# EasyEDA Pro project ProPrj_OpenHaldexC6_2025-10-16.epro

# Schematic Schematic1
Board Name: Board1; Create Date: 2025-10-07; Page Name: P1; Project Name: OpenHaldexC6; Schematic Name: Schematic1; Update Date: 2025-10-15; Company: EasyEDA.com; Page Size: A4; Version: V1.0
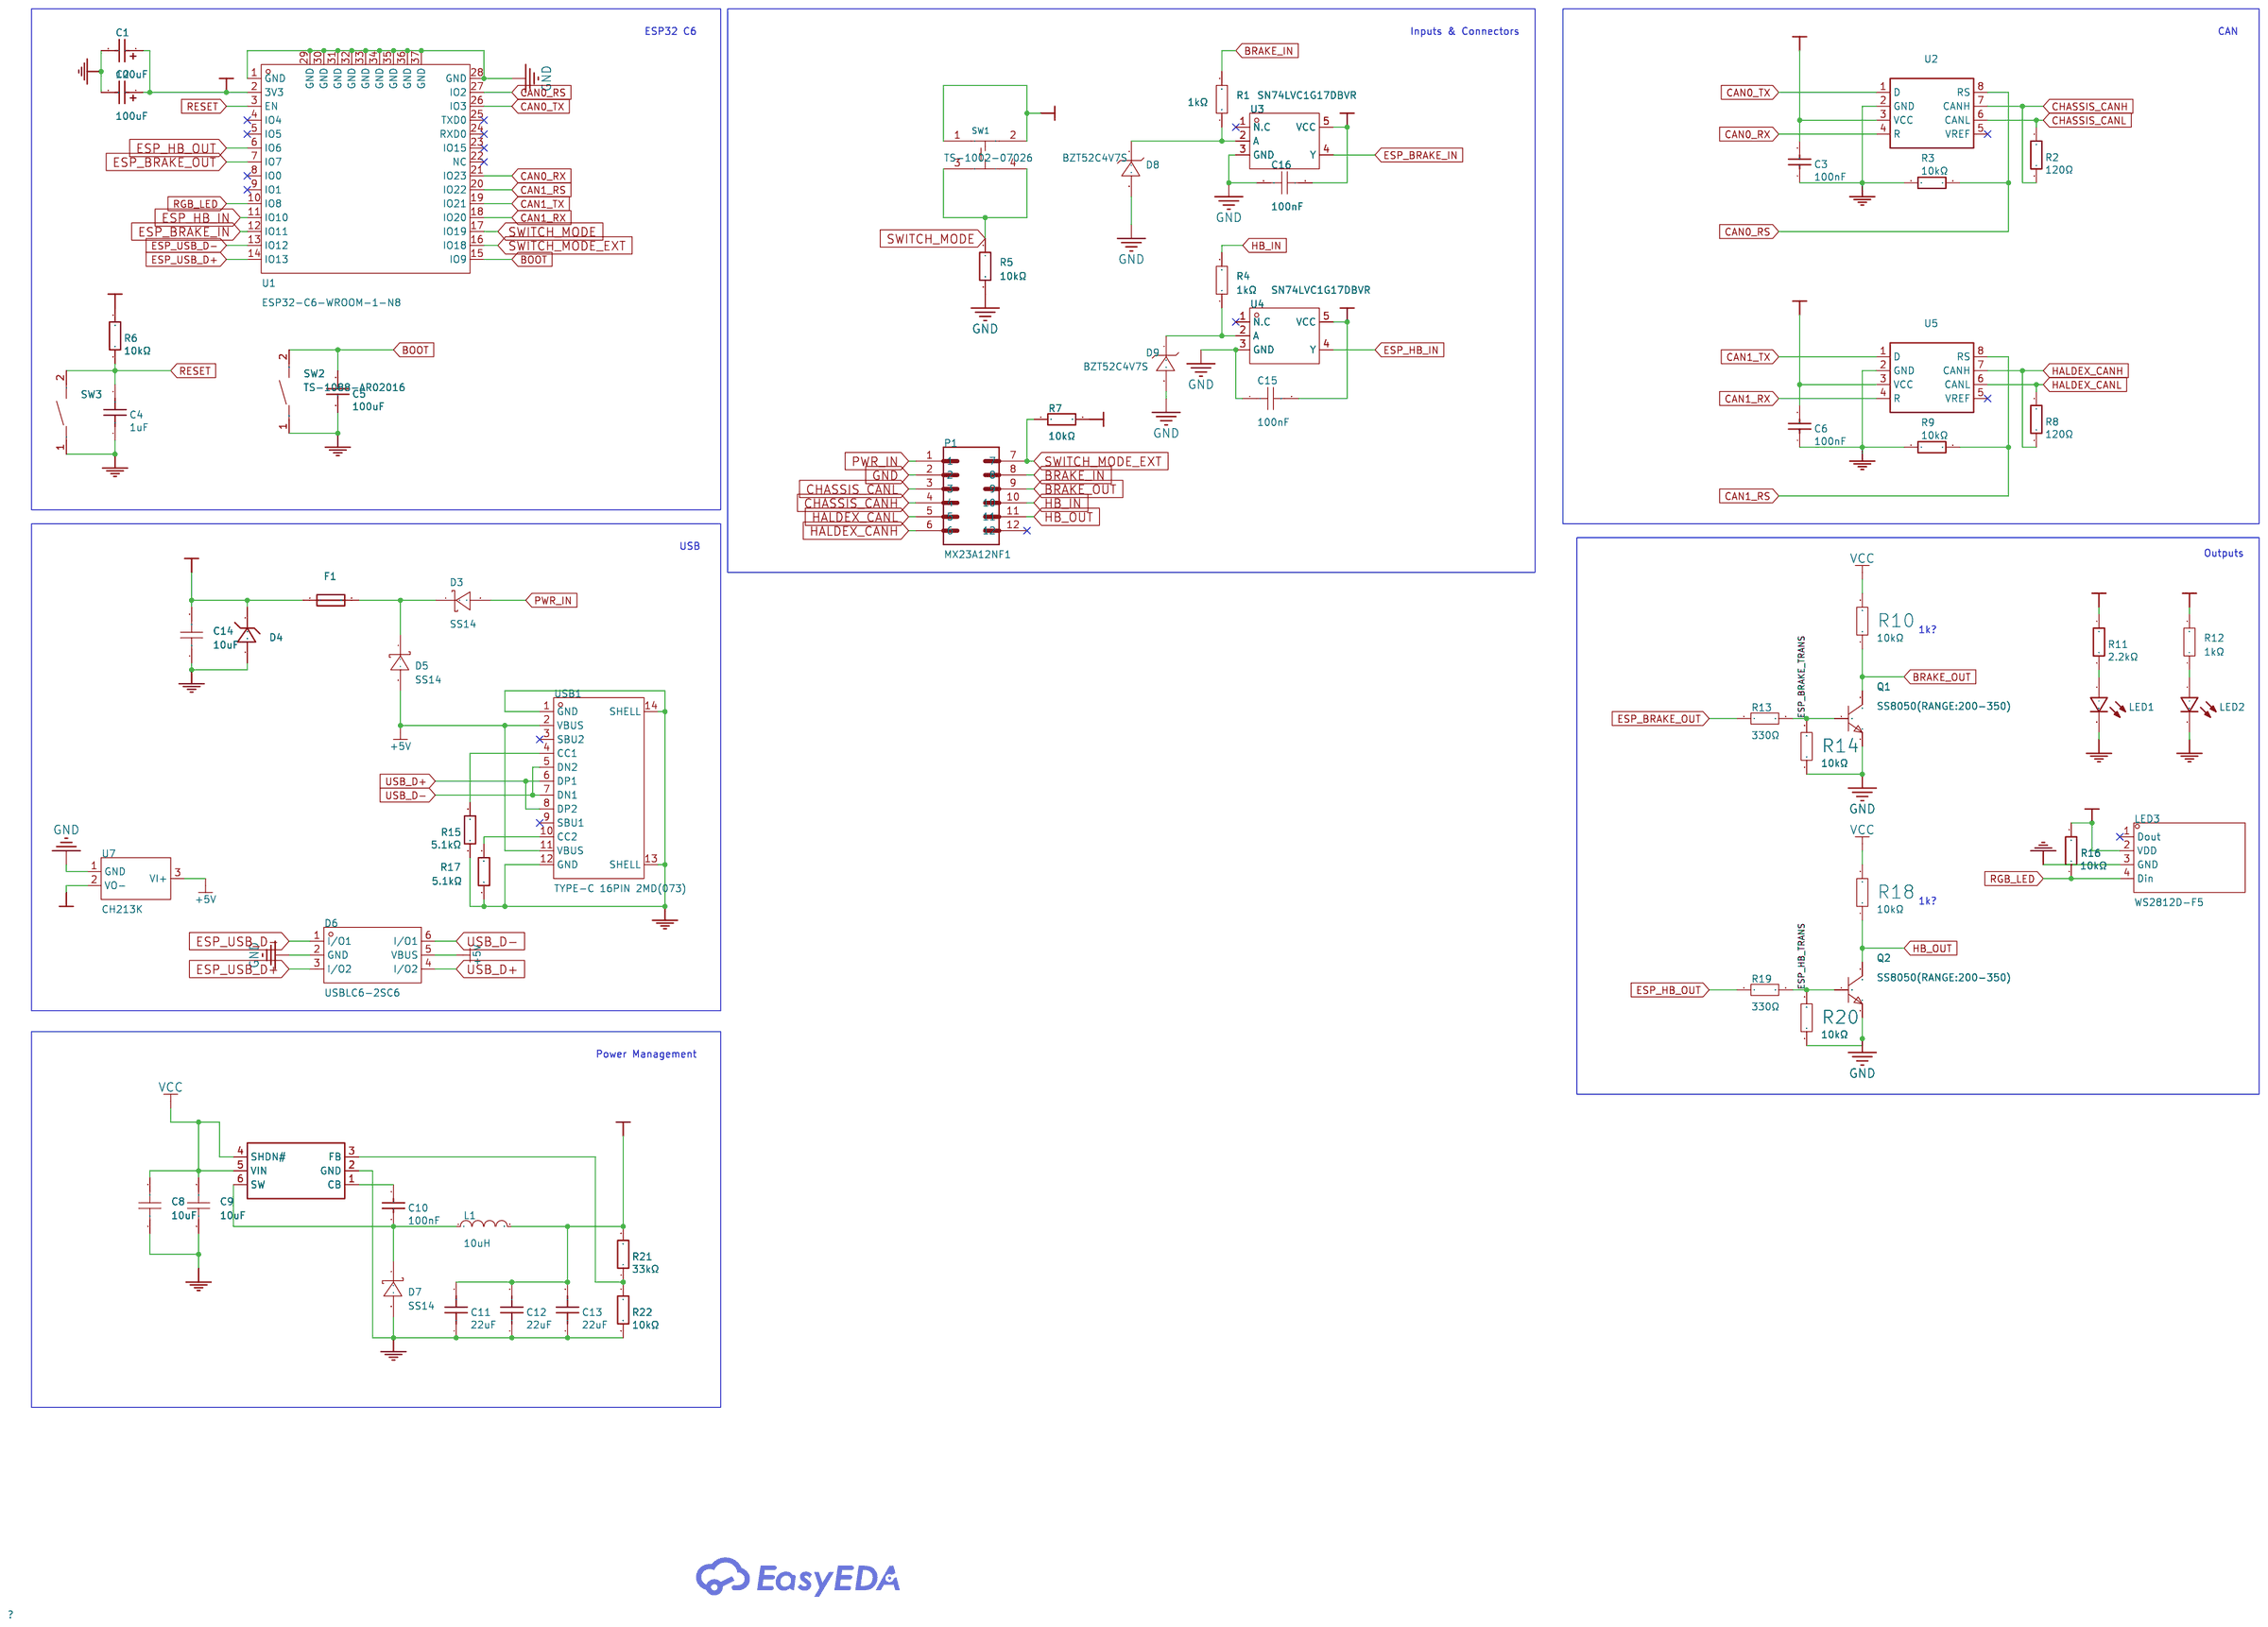
[diagram p0: schematic sheet]

## Parts
C1  100uF  [CASE-B_3528]
C2  100uF  [CASE-B_3528]
C3  100nF  [C0402]
C4  1uF  [C0402]
C5  100uF  [CASE-B_3528]
C6  100nF  [C0402]
C8  10uF  [C1206]
C9  10uF  [C1206]
C10  100nF  [C0402]
C11  22uF  [C0603]
C12  22uF  [C0603]
C13  22uF  [C0603]
C14  10uF  [C1206]
C15  100nF  [C0603]
C16  100nF  [C0603]
D3  SS14  [SMA_L4.2-W2.6-LS5.0-RD_1]
D4  SMF30A  [SOD-123_L2.8-W1.8-LS3.7-RD]
D5  SS14  [SMA_L4.2-W2.6-LS5.0-RD_1]
D6  USBLC6-2SC6  [SOT-23-6_L2.9-W1.6-P0.95-LS2.8-BL]
D7  SS14  [SMA_L4.2-W2.6-LS5.0-RD_1]
D8  BZT52C4V7S  [SOD-323_L1.8-W1.3-LS2.5-RD]
D9  BZT52C4V7S  [SOD-323_L1.8-W1.3-LS2.5-RD]
F1  MF-MSMF110/16-2  [F1812]
L1  10uH  [IND-SMD_L6.0-W6.0_FNR60XXS]
LED1  19-217/GHC-YR1S2/3T  [LED0603-RD]
LED2  19-217/GHC-YR1S2/3T  [LED0603-RD]
LED3  WS2812D-F5  [LED-TH_4P-BD5.8-P1.30]
P1  MX23A12NF1  [COON-TH_MX23A12NF1]
Q1  SS8050(RANGE:200-350)  [SOT-23-3_L2.9-W1.3-P1.90-LS2.4-BR]
Q2  SS8050(RANGE:200-350)  [SOT-23-3_L2.9-W1.3-P1.90-LS2.4-BR]
R1  1kΩ  [R0603]
R2  120Ω  [R1206]
R3  10kΩ  [R0402]
R4  1kΩ  [R0603]
R5  10kΩ  [R0402]
R6  10kΩ  [R0402]
R7  10kΩ  [R0402]
R8  120Ω  [R1206]
R9  10kΩ  [R0402]
R10  10kΩ  [R0603]
R11  2.2kΩ  [R0402]
R12  1kΩ  [R0402]
R13  330Ω  [R0603]
R14  10kΩ  [R0603]
R15  5.1kΩ  [R0402]
R16  10kΩ  [R0402]
R17  5.1kΩ  [R0402]
R18  10kΩ  [R0603]
R19  330Ω  [R0603]
R20  10kΩ  [R0603]
R21  33kΩ  [R0402]
R22  10kΩ  [R0402]
SW1  TS-1002-07026  [SW-TH_4P-L6.0-W6.0-P4.50-LS6.5]
SW2  TS-1088-AR02016  [SW-SMD_L3.9-W3.0-P4.45]
SW3  TS-1088-AR02016  [SW-SMD_L3.9-W3.0-P4.45]
U1  ESP32-C6-WROOM-1-N8  [WIRELM-SMD_ESP32-C6-WROOM-1]
U2  SN65HVD230DR  [SOIC-8_L4.9-W3.9-P1.27-LS6.0-BL]
U3  SN74LVC1G17DBVR  [SOT-23-5_L3.0-W1.5-P0.95-LS2.8-BL]
U4  SN74LVC1G17DBVR  [SOT-23-5_L3.0-W1.5-P0.95-LS2.8-BL]
U5  SN65HVD230DR  [SOIC-8_L4.9-W3.9-P1.27-LS6.0-BL]
U6  LMR14006XDDCR  [SOT-23-6_L2.9-W1.6-P0.95-LS2.8-BL]
U7  CH213K  [SOT-23-3_L2.9-W1.6-P1.90-LS2.8-BR]
USB1  TYPE-C 16PIN 2MD(073)  [USB-C-SMD_TYPE-C-6PIN-2MD-073]

## Library data of the parts
C1 C2 C5 = TAJB107K006RNJ: Capacitance:100uF Tolerance:±10% Tolerance:±10% Voltage Rating:6.3V Equivalent Series Resistance(ESR):1.7Ω@100kHz Operating Temperature:-55℃~+125℃ Operating Temperature:-55℃~+125℃; LCSC Part Name: 100uF ±10% 6.3V; Supplier Part: C16133; Manufacturer: Kyocera AVX; Supplier Footprint: CASE-B-3528-21(mm); JLCPCB Part Class: Basic Part; Supplier: LCSC; Tolerance: ±10%; Voltage Rating: 6.3V; Equivalent Series Resistance(ESR): 1.7Ω@100kHz; Operating Temperature: -55℃~+125℃
C3 C6 C10 = CL05B104KO5NNNC: Capacitance:100nF Tolerance:±10% Tolerance:±10% Voltage Rating:16V Temperature Coefficient:X7R; LCSC Part Name: 100nF ±10% 16V; Supplier Part: C1525; Manufacturer: SAMSUNG(三星); Supplier Footprint: 0402; JLCPCB Part Class: Basic Part; Datasheet: https://item.szlcsc.com/datasheet/CL05B104KO5NNNC/1877.html; Supplier: LCSC; Tolerance: ±10%; Voltage Rating: 16V; Temperature Coefficient: X7R
C4 = CL05A105KA5NQNC: Capacitance:1uF Tolerance:±10% Tolerance:±10% Voltage Rating:25V Temperature Coefficient:X5R; LCSC Part Name: 1uF ±10% 25V; Supplier Part: C52923; Manufacturer: SAMSUNG(三星); Supplier Footprint: 0402; JLCPCB Part Class: Basic Part; Datasheet: https://item.szlcsc.com/datasheet/CL05A105KA5NQNC/53938.html; Supplier: LCSC; Tolerance: ±10%; Voltage Rating: 25V; Temperature Coefficient: X5R
C8 C9 C14 = CS3216X7R106K350NRI: Capacitance:10uF Tolerance:±10% Tolerance:±10% Voltage Rating:35V Temperature Coefficient:-; LCSC Part Name: 10uF ±10% 35V; Supplier Part: C920965; Manufacturer: SAMWHA(三和); Supplier Footprint: 1206; JLCPCB Part Class: Extended Part; Supplier: LCSC; Tolerance: ±10%; Voltage Rating: 35V
C11-C13 = CL10A226MQ8NRNC: Capacitance:22uF Tolerance:±20% Tolerance:±20% Voltage Rating:6.3V Temperature Coefficient:X5R; LCSC Part Name: 22uF ±20% 6.3V; Supplier Part: C59461; Manufacturer: SAMSUNG(三星); Supplier Footprint: 0603; JLCPCB Part Class: Basic Part; Datasheet: https://item.szlcsc.com/datasheet/CL10A226MQ8NRNC/60514.html; Supplier: LCSC; Tolerance: ±20%; Voltage Rating: 6.3V; Temperature Coefficient: X5R
C15 C16 = CC0603KRX7R9BB104: Capacitance:100nF Tolerance:±10% Tolerance:±10% Voltage Rating:50V Temperature Coefficient:X7R; LCSC Part Name: 100nF ±10% 50V; Supplier Part: C14663; Manufacturer: YAGEO(国巨); Supplier Footprint: 0603; JLCPCB Part Class: Basic Part; Datasheet: https://item.szlcsc.com/datasheet/CC0603KRX7R9BB104/15331.html; Supplier: LCSC; Tolerance: ±10%; Voltage Rating: 50V; Temperature Coefficient: X7R
D3 D5 D7 = SS14_C2480: Diode Configuration:Independent Voltage - Forward(Vf@If):550mV@1A Voltage - DC Reverse(Vr):40V Current - Rectified:1A Reverse Leakage Current (Ir):300uA@40V Operating Junction Temperature Range:-55℃~+150℃ Operating Junction Temperature Range:-55℃~+150℃ No; LCSC Part Name: 电压:40V 电流:1A; Supplier Part: C2480; Manufacturer: MDD(辰达半导体); Supplier Footprint: SMA(DO-214AC); JLCPCB Part Class: Basic Part; Datasheet: https://item.szlcsc.com/datasheet/SS14/2857.html; Supplier: LCSC; Diode Configuration: Independent; Voltage - Forward(Vf@If): 550mV@1A; Voltage - DC Reverse(Vr): 40V; Current - Rectified: 1A; Reverse Leakage Current (Ir): 300uA@40V; Operating Junction Temperature Range: -55℃~+150℃; Non-Repetitive Peak Forward Surge Current: 25A
D4 = SMF30A_C366558: Reverse Stand-Off Voltage (Vrwm):30V Maximum Clamping Voltage:48.4V Peak Pulse Current (Ipp)@10/1000us:4.13A Breakdown Voltage:33.3V Type:TVS; Supplier Part: C366558; Manufacturer: DOWO(东沃); Supplier Footprint: SOD-123; JLCPCB Part Class: Extended Part; Datasheet: https://atta.szlcsc.com/upload/public/pdf/source/20190724/C406703_27801748953EFFDC130565EABDC01129.pdf; Supplier: LCSC; Reverse Stand-Off Voltage (Vrwm): 30V; Maximum Clamping Voltage: 48.4V; Peak Pulse Current (Ipp)@10/1000us: 4.13A; Breakdown Voltage: 33.3V; Type: TVS
D6 = USBLC6-2SC6_C2687116: Maximum Clamping Voltage:15V Breakdown Voltage:6V Number of Lines:双路 Type:ESD; Supplier Part: C2687116; Manufacturer: UMW(友台半导体); Supplier Footprint: SOT-23-6; JLCPCB Part Class: Extended Part; Datasheet: https://atta.szlcsc.com/upload/public/pdf/source/20231109/512642D850D9873E7C519F71E85B9A10.pdf; Supplier: LCSC; Maximum Clamping Voltage: 15V; Breakdown Voltage: 6V; Number of Lines: 双路; Type: ESD
D8 D9 = BZT52C4V7S_C353517: Diode Configuration:Independent Zener Voltage(Nom):4.7V Reverse Leakage Current (Ir):3uA@2V Zener Voltage(Range):4.4V~5V Zener Voltage(Range):4.4V~5V Pd - Power Dissipation:200mW Impedance(Zzt):80Ω Operating Junction Temperature Range:-55℃~+150℃ Operating; LCSC Part Name: 独立式 耐压:4.7V 电流:3uA@2V; Supplier Part: C353517; Manufacturer: 晶导微电子; Supplier Footprint: SOD-323; JLCPCB Part Class: Extended Part; Datasheet: https://item.szlcsc.com/datasheet/BZT52C4V7S/329266.html; Supplier: LCSC; Diode Configuration: Independent; Zener Voltage(Nom): 4.7V; Reverse Leakage Current (Ir): 3uA@2V; Zener Voltage(Range): 4.4V~5V; Pd - Power Dissipation: 200mW; Impedance(Zzt): 80Ω; Operating Junction Temperature Range: -55℃~+150℃
F1 = MF-MSMF110/16-2: Voltage - Max:- Current - Max:- Hold Current:- Trip Current:- Power Dissipation:800mW Resistance - Initial (Ri) (Min):40mΩ Resistance - Post Trip (R1) (Max):210mΩ Time to Trip(Max):- Operating Temperature:-40℃~+85℃ Operating Temperature:-40℃~+85℃ Length:-; LCSC Part Name: 16V 1.1A 1812自恢复; Supplier Part: C210834; Manufacturer: BOURNS; Supplier Footprint: 1812; JLCPCB Part Class: Extended Part; Datasheet: https://item.szlcsc.com/datasheet/MF-MSMF110%252F16-2/211712.html; Supplier: LCSC; Power Dissipation: 800mW; Resistance - Initial (Ri) (Min): 40mΩ; Resistance - Post Trip (R1) (Max): 210mΩ; Operating Temperature: -40℃~+85℃
L1 = FNR6045S100MT: Inductance:10uH Tolerance:±20% Tolerance:±20% Current Rating:2.7A Current - Saturation(Isat):3.5A DC Resistance(DCR):0.062Ω Type:Magnetic Core Shielded Winding Alloy Inductor; LCSC Part Name: 10uH ±20% 3.5A; Supplier Part: C168076; Manufacturer: cjiang(长江微电); Supplier Footprint: SMD,6x6mm; JLCPCB Part Class: Extended Part; Datasheet: https://atta.szlcsc.com/upload/public/pdf/source/20190327/C167925_9EFF0AABC4CA629C2CC95961DBF7D39D.pdf; Supplier: LCSC; Tolerance: ±20%; Current Rating: 2.7A; Current - Saturation(Isat): 3.5A; DC Resistance(DCR): 0.062Ω; Type: Magnetic Core Shielded Winding Alloy Inductor
LED1 LED2 = 19-217/GHC-YR1S2/3T: Illumination Color:Emerald Green Voltage - Forward(Vf):3.3V Voltage - Forward(Vf):3.3V Power(Watts):110mW Forward Current:20mA Wavelength - Dominant:520nm~535nm Wavelength - Dominant:520nm~535nm Peak Wavelength:518nm Diode Configuration:- Lens Color:Water; LCSC Part Name: 翠绿 停产; Supplier Part: C72043; Manufacturer: EVERLIGHT(亿光); Supplier Footprint: 0603; JLCPCB Part Class: Extended Part; Supplier: LCSC; Illumination Color: Emerald Green; Voltage - Forward(Vf): 3.3V; Power(Watts): 110mW; Forward Current: 20mA; Wavelength - Dominant: 520nm~535nm; Peak Wavelength: 518nm; Lens Color: Water Clear; Luminous Intensity: 199mcd; Viewing Angle: 120°; Operating Temperature: -40℃~+85℃
LED3 = WS2812D-F5: Wavelength:R:620nm~625nm；B:465nm~470nm；G:520nm~525nm Luminous Intensity:G:4000mcd；R:3000mcd；B:2500mcd Fixed-Frequency Pwm Mode:2kHz Data Transmission Rate:800Kbit/s Voltage - Supply:3.7V~5.3V Voltage - Supply:3.7V~5.3V Operating Temperature:-25℃~+85℃ Peak; LCSC Part Name: 智能控制通孔式LED集成光源; Supplier Part: C190565; Manufacturer: worldsemi; Supplier Footprint: 插件,D=5mm; JLCPCB Part Class: Extended Part; Datasheet: https://item.szlcsc.com/datasheet/WS2812D-F5/211094.html; Supplier: LCSC; Wavelength: R:620nm~625nm；B:465nm~470nm；G:520nm~525nm; Luminous Intensity: G:4000mcd；R:3000mcd；B:2500mcd; Fixed-Frequency Pwm Mode: 2kHz; Data Transmission Rate: 800Kbit/s; Voltage - Supply: 3.7V~5.3V; Operating Temperature: -25℃~+85℃; Peak Wavelength: G:522.5nm；R:622.5nm；B:467.5nm
P1 = MX23A12NF1: Supplier Part: C5359486; Manufacturer: JAE(日本航空电子); JLCPCB Part Class: Extended Part; Datasheet: https://atta.szlcsc.com/upload/public/pdf/source/20230330/B7F7CF0886F51BD2154D3E2774694052.pdf; Supplier: LCSC
Q1 Q2 = SS8050(RANGE:200-350)_C2150: type:NPN Current - Collector(Ic):1.5A Collector - Emitter Voltage VCEO:25V Pd - Power Dissipation:300mW DC Current Gain:200@800mA,1V DC Current Gain:200@800mA,1V Transition frequency(fT):100MHz Current - Collector Cutoff:100nA Vce Saturation(VCE(sat)):500; LCSC Part Name: hfe=200~350 NPN 电流:1.5A 电压:25V; Supplier Part: C2150; Manufacturer: CJ(江苏长电/长晶); Supplier Footprint: SOT-23; JLCPCB Part Class: Basic Part; Datasheet: https://item.szlcsc.com/datasheet/SS8050(RANGE%253A200-350)/2507.html; Supplier: LCSC; type: NPN; Current - Collector(Ic): 1.5A; Collector - Emitter Voltage VCEO: 25V; Pd - Power Dissipation: 300mW; DC Current Gain: 200@800mA,1V; Transition frequency(fT): 100MHz; Current - Collector Cutoff: 100nA; Vce Saturation(VCE(sat)): 500mV@800mA,80mA; Operating Temperature: -55℃~+150℃; Emitter-Base Voltage(Vebo): 5V; Number: 1 NPN
R1 R4 = 0603WAF1001T5E: Type:Thick Film Resistors Resistance:1kΩ Tolerance:±1% Tolerance:±1% Power(Watts): Overload Voltage (Max): Temperature Coefficient:±100ppm/℃ Temperature Coefficient:±100ppm/℃ Operating Temperature Range:-55℃~+155℃ Operating Temperature Range:-55℃~+155℃; LCSC Part Name: 1kΩ ±1% 100mW 厚膜电阻; Supplier Part: C21190; Manufacturer: UNI-ROYAL(厚声); Supplier Footprint: 0603; JLCPCB Part Class: Basic Part; Datasheet: https://atta.szlcsc.com/upload/public/pdf/source/20200306/C422600_1E6D84923E4A46A82E41ADD87F860B5C.pdf; Supplier: LCSC; Type: Thick Film Resistors; Tolerance: ±1%; Temperature Coefficient: ±100ppm/℃; Operating Temperature Range: -55℃~+155℃; Check: true
R2 R8 = RTT061200FTP: Type:Thick Film Resistor Resistance:120Ω Tolerance:±1% Tolerance:±1% Power(Watts):250mW Voltage-Supply(Max):150V Temperature Coefficient:±100ppm/℃ Temperature Coefficient:±100ppm/℃ Operating Temperature:-55℃~+155℃ Operating Temperature:-55℃~+155℃; LCSC Part Name: 厚膜电阻 120Ω ±1% 250mW; Supplier Part: C159715; Manufacturer: RALEC(旺诠); Supplier Footprint: 1206; JLCPCB Part Class: Extended Part; Datasheet: https://item.szlcsc.com/datasheet/RTT061200FTP/171094.html; Supplier: LCSC; Type: Thick Film Resistor; Tolerance: ±1%; Power(Watts): 250mW; Voltage-Supply(Max): 150V; Temperature Coefficient: ±100ppm/℃; Operating Temperature: -55℃~+155℃
R3 R5-R7 R9 R16 R22 = 0402WGF1002TCE: Type:Thick Film Resistor Resistance:10kΩ Tolerance:±1% Tolerance:±1% Power(Watts):62.5mW Voltage-Supply(Max):50V Temperature Coefficient:±100ppm/℃ Temperature Coefficient:±100ppm/℃ Operating Temperature:-55℃~+155℃ Operating Temperature:-55℃~+155℃; LCSC Part Name: 10kΩ ±1% 62.5mW 厚膜电阻; Supplier Part: C25744; Manufacturer: UNI-ROYAL(厚声); Supplier Footprint: 0402; JLCPCB Part Class: Basic Part; Datasheet: https://item.szlcsc.com/datasheet/0402WGF1002TCE/26487.html; Supplier: LCSC; Type: Thick Film Resistor; Tolerance: ±1%; Power(Watts): 62.5mW; Voltage-Supply(Max): 50V; Temperature Coefficient: ±100ppm/℃; Operating Temperature: -55℃~+155℃
R10 R14 R18 R20 = 0603WAF1002T5E: Type:Thick Film Resistor Resistance:10kΩ Tolerance:±1% Tolerance:±1% Power(Watts):100mW Voltage-Supply(Max):75V Temperature Coefficient:±100ppm/℃ Temperature Coefficient:±100ppm/℃ Operating Temperature:-55℃~+155℃ Operating Temperature:-55℃~+155℃; LCSC Part Name: 厚膜电阻 10kΩ ±1% 100mW; Supplier Part: C25804; Manufacturer: UNI-ROYAL(厚声); Supplier Footprint: 0603; JLCPCB Part Class: Basic Part; Datasheet: https://atta.szlcsc.com/upload/public/pdf/source/20200306/C422600_1E6D84923E4A46A82E41ADD87F860B5C.pdf; Supplier: LCSC; Type: Thick Film Resistor; Tolerance: ±1%; Power(Watts): 100mW; Voltage-Supply(Max): 75V; Temperature Coefficient: ±100ppm/℃; Operating Temperature: -55℃~+155℃; Check: true
R11 = 0402WGF2201TCE: Type:Thick Film Resistor Resistance:2.2kΩ Tolerance:±1% Tolerance:±1% Power(Watts):62.5mW Voltage-Supply(Max):50V Temperature Coefficient:±100ppm/℃ Temperature Coefficient:±100ppm/℃ Operating Temperature:-55℃~+155℃ Operating Temperature:-55℃~+155℃; LCSC Part Name: 2.2kΩ ±1% 62.5mW 厚膜电阻; Supplier Part: C25879; Manufacturer: UNI-ROYAL(厚声); Supplier Footprint: 0402; JLCPCB Part Class: Basic Part; Datasheet: https://item.szlcsc.com/datasheet/0402WGF2201TCE/26622.html; Supplier: LCSC; Type: Thick Film Resistor; Tolerance: ±1%; Power(Watts): 62.5mW; Voltage-Supply(Max): 50V; Temperature Coefficient: ±100ppm/℃; Operating Temperature: -55℃~+155℃
R12 = 0402WGF1001TCE: Type:Thick Film Resistor Resistance:1kΩ Tolerance:±1% Tolerance:±1% Power(Watts):62.5mW Voltage-Supply(Max):50V Temperature Coefficient:±100ppm/℃ Temperature Coefficient:±100ppm/℃ Operating Temperature:-55℃~+155℃ Operating Temperature:-55℃~+155℃; LCSC Part Name: 1kΩ ±1% 62.5mW 厚膜电阻; Supplier Part: C11702; Manufacturer: UNI-ROYAL(厚声); Supplier Footprint: 0402; JLCPCB Part Class: Basic Part; Datasheet: https://item.szlcsc.com/datasheet/0402WGF1001TCE/12256.html; Supplier: LCSC; Type: Thick Film Resistor; Tolerance: ±1%; Power(Watts): 62.5mW; Voltage-Supply(Max): 50V; Temperature Coefficient: ±100ppm/℃; Operating Temperature: -55℃~+155℃
R13 R19 = 0603WAF3300T5E: Type:Thick Film Resistors Resistance: Tolerance:±1% Tolerance:±1% Power(Watts): Overload Voltage (Max): Temperature Coefficient:±100ppm/℃ Temperature Coefficient:±100ppm/℃ Operating Temperature Range:-55℃~+155℃ Operating Temperature Range:-55℃~+155℃; LCSC Part Name: 330Ω ±1% 100mW 厚膜电阻; Supplier Part: C23138; Manufacturer: UNI-ROYAL(厚声); Supplier Footprint: 0603; JLCPCB Part Class: Basic Part; Datasheet: https://atta.szlcsc.com/upload/public/pdf/source/20200306/C422600_1E6D84923E4A46A82E41ADD87F860B5C.pdf; Supplier: LCSC; Type: Thick Film Resistors; Tolerance: ±1%; Temperature Coefficient: ±100ppm/℃; Operating Temperature Range: -55℃~+155℃; Check: true
R15 R17 = 0402WGF5101TCE: Type:Thick Film Resistor Resistance:5.1kΩ Tolerance:±1% Tolerance:±1% Power(Watts):62.5mW Voltage-Supply(Max):50V Temperature Coefficient:±100ppm/℃ Temperature Coefficient:±100ppm/℃ Operating Temperature:-55℃~+155℃ Operating Temperature:-55℃~+155℃; LCSC Part Name: 5.1kΩ ±1% 62.5mW 厚膜电阻; Supplier Part: C25905; Manufacturer: UNI-ROYAL(厚声); Supplier Footprint: 0402; JLCPCB Part Class: Basic Part; Datasheet: https://item.szlcsc.com/datasheet/0402WGF5101TCE/26648.html; Supplier: LCSC; Type: Thick Film Resistor; Tolerance: ±1%; Power(Watts): 62.5mW; Voltage-Supply(Max): 50V; Temperature Coefficient: ±100ppm/℃; Operating Temperature: -55℃~+155℃
R21 = 0402WGF3302TCE: Type:Thick Film Resistors Resistance:33kΩ Tolerance:±1% Tolerance:±1% Power(Watts): Overload Voltage (Max): Temperature Coefficient:±100ppm/℃ Temperature Coefficient:±100ppm/℃ Operating Temperature Range:-55℃~+155℃ Operating Temperature Range:-55℃~+155℃; LCSC Part Name: 33kΩ ±1% 62.5mW 厚膜电阻; Supplier Part: C25779; Manufacturer: UNI-ROYAL(厚声); Supplier Footprint: 0402; JLCPCB Part Class: Basic Part; Datasheet: https://atta.szlcsc.com/upload/public/pdf/source/20200306/C422600_1E6D84923E4A46A82E41ADD87F860B5C.pdf; Supplier: LCSC; Type: Thick Film Resistors; Tolerance: ±1%; Temperature Coefficient: ±100ppm/℃; Operating Temperature Range: -55℃~+155℃
SW1 = TS-1002-07026: Circuit:SPST Actuator Style:Round Button Mounting Type:Through Hole Length:6mm Width:6mm Switch Height:7mm Contact Current:50mA Voltage Rating:12V With Lamp:- Life:-; LCSC Part Name: 6*6*7mm 直插 轻触开关; Supplier Part: C455095; Manufacturer: XUNPU(讯普); Supplier Footprint: 插件,6x6mm; JLCPCB Part Class: Extended Part; Datasheet: https://item.szlcsc.com/datasheet/TS-1002-07026/457500.html; Supplier: LCSC; Circuit: SPST; Actuator Style: Round Button; Mounting Type: Through Hole; Length: 6mm; Width: 6mm; Switch Height: 7mm; Contact Current: 50mA; Voltage Rating: 12V
SW2 SW3 = TS-1088-AR02016: Circuit:SPST Actuator Style:Round Button Operating Force:1.6N Mounting Type:Surface Mount,Vertical Length:4mm Width:3mm Switch Height:2mm with Bracket:Without Bracket Contact Current:50mA Voltage Rating:12V Actuator/Cap Color:Black Termination Style:SMD(S; LCSC Part Name: 4*3*2mm 立贴 轻触开关; Supplier Part: C720477; Manufacturer: XUNPU(讯普); Supplier Footprint: SMD; JLCPCB Part Class: Basic Part; Datasheet: https://item.szlcsc.com/datasheet/TS-1088-AR02016/763484.html; Supplier: LCSC; Circuit: SPST; Actuator Style: Round Button; Operating Force: 1.6N; Mounting Type: Surface Mount,Vertical; Length: 4mm; Width: 3mm; Switch Height: 2mm; with Bracket: Without Bracket; Contact Current: 50mA; Voltage Rating: 12V; Actuator/Cap Color: Black; Termination Style: SMD(SMT) Tab; Life: 100,000 Cycles; Operating Temperature: -30℃~+80℃
U1 = ESP32-C6-WROOM-1-N8: Supplier Part: C5366877; Manufacturer: ESPRESSIF(乐鑫); JLCPCB Part Class: Extended Part; Datasheet: https://item.szlcsc.com/datasheet/ESP32-C6-WROOM-1-N8/6203223.html; Supplier: LCSC
U2 U5 = SN65HVD230DR: Type:CANtransceiver Data Rate:1Mbps Voltage - Supply:- Voltage - Supply:- Current - Supply:- Operating Temperature:-40℃~+85℃ Operating Temperature:-40℃~+85℃; LCSC Part Name: 3.3-V CAN 收发器; Supplier Part: C12084; Manufacturer: TI(德州仪器); Supplier Footprint: SOIC-8; JLCPCB Part Class: Extended Part; Datasheet: https://www.ti.com/cn/lit/gpn/sn65hvd230; Supplier: LCSC; Type: CANtransceiver; Data Rate: 1Mbps; Operating Temperature: -40℃~+85℃
U3 U4 = SN74LVC1G17DBVR_C19829662: Supplier Part: C19829662; Manufacturer: TECH PUBLIC(台舟); Supplier Footprint: SOT-23-5; JLCPCB Part Class: Extended Part; Datasheet: https://atta.szlcsc.com/upload/public/pdf/source/20240202/EAF8B4F29332307745EEFE11873F995E.pdf; Supplier: LCSC
U6 = LMR14006XDDCR: Function:Buck Output Type:Adjustable Voltage - Supply:4V~40V Voltage - Supply:4V~40V Output Voltage:765mV~38.4V Output Voltage:765mV~38.4V Output Current:600mA Frequency - Switching:1.1MHz Frequency - Switching:1.1MHz Operating Temperature:-40℃~+125℃@(TJ); LCSC Part Name: 40V 600mA Buck 调节器，具备高效睡眠模式; Supplier Part: C478074; Manufacturer: TI(德州仪器); Supplier Footprint: TSOT-23-6; JLCPCB Part Class: Extended Part; Datasheet: https://www.ti.com/cn/lit/gpn/lmr14006; Supplier: LCSC; Function: Buck; Output Type: Adjustable; Voltage - Supply: 4V~40V; Output Voltage: 765mV~38.4V; Output Current: 600mA; Frequency - Switching: 1.1MHz; Operating Temperature: -40℃~+125℃@(TJ); Synchronous Rectifier: No; Number of Outputs: 1; Topology: Buck; Switch tube (built-in/external): Built-In
U7 = CH213K: Supplier Part: C5456874; Manufacturer: WCH(南京沁恒); Supplier Footprint: SOT-23-3; JLCPCB Part Class: Extended Part; Datasheet: https://item.szlcsc.com/datasheet/CH213K/6369803.html; Supplier: LCSC
USB1 = TYPE-C 16PIN 2MD(073): Connector Type:Type-C Protocol Standard:- Gender:Female Mounting Type:Surface Mount, Right Angle Number of Contacts:16P Number of Ports:1 Current Rating-Power:3A Voltage Rating:5V Connect-Disconnect Life:5,000 Cycles Supplementary Features:- Center Height; LCSC Part Name: Type-C 母 卧贴; Supplier Part: C2765186; Manufacturer: SHOU HAN(首韩); Supplier Footprint: SMD; JLCPCB Part Class: Extended Part; Datasheet: https://item.szlcsc.com/datasheet/TYPE-C%252016PIN%25202MD(073)/2901843.html; Supplier: LCSC; Connector Type: Type-C; Gender: Female; Mounting Type: Surface Mount, Right Angle; Number of Contacts: 16P; Number of Ports: 1; Current Rating-Power: 3A; Voltage Rating: 5V; Connect-Disconnect Life: 5,000 Cycles; Detection color: Black; Operating Temperature: -25℃~+85℃

## Nets
3V3: C1.1 C2.1 C3.2 C6.2 C11.2 C12.2 C13.2 C15.2 C16.2 L1.2 LED3.2(VDD) R6.2 R7.2 R12.2 R16.2 R21.2 SW1.1 SW1.2 U1.2(3V3) U2.3(VCC) U3.5(VCC) U4.5(VCC) U5.3(VCC)
+5V: D5.2(A) D6.5(VBUS) U7.3(VI+) USB1.2(VBUS) USB1.11(VBUS)
GND: C1.2 C2.2 C3.1 C4.1 C5.1 C6.1 C8.1 C9.1 C11.1 C12.1 C13.1 C14.1 C15.1 C16.1 D4.2 D6.2(GND) D7.2(A) D8.2(A) D9.2(A) LED1.2(C) LED2.2(C) LED3.3(GND) P1.2 Q1.2(E) Q2.2(E) R3.1 R5.2 R9.1 R14.1 R15.1 R17.1 R20.1 R22.2 SW2.1 SW3.1 U1.1(GND) U1.28(GND) U1.29(GND) U1.30(GND) U1.31(GND) U1.32(GND) U1.33(GND) U1.34(GND) U1.35(GND) U1.36(GND) U1.37(GND) U2.2(GND) U3.3(GND) U4.3(GND) U5.2(GND) U6.2(GND) U7.1(GND) USB1.1(GND) USB1.12(GND) USB1.13(SHELL) USB1.14(SHELL)
VCC: C8.2 C9.2 C14.2 D4.1 F1.1 R10.2 R11.1 R18.2 U6.4(SHDN#) U6.5(VIN) U7.2(VO-)
BOOT: C5.2 SW2.2 U1.15(IO9)
BRAKE_IN: P1.8 R1.2
BRAKE_OUT: P1.9 Q1.3(C) R10.1
CAN0_RS: R3.2 U1.27(IO2) U2.8(RS)
CAN0_RX: U1.21(IO23) U2.4(R)
CAN0_TX: U1.26(IO3) U2.1(D)
CAN1_RS: R9.2 U1.20(IO22) U5.8(RS)
CAN1_RX: U1.18(IO20) U5.4(R)
CAN1_TX: U1.19(IO21) U5.1(D)
CHASSIS_CANH: P1.4 R2.2 U2.7(CANH)
CHASSIS_CANL: P1.3 R2.1 U2.6(CANL)
ESP_BRAKE_IN: U1.12(IO11) U3.4(Y)
ESP_BRAKE_OUT: R13.1 U1.7(IO7)
ESP_BRAKE_TRANS: Q1.1(B) R13.2 R14.2
ESP_HB_IN: U1.11(IO10) U4.4(Y)
ESP_HB_OUT: R19.1 U1.6(IO6)
ESP_HB_TRANS: Q2.1(B) R19.2 R20.2
ESP_USB_D+: D6.3(I/O2) U1.14(IO13)
ESP_USB_D-: D6.1(I/O1) U1.13(IO12)
HALDEX_CANH: P1.6 R8.2 U5.7(CANH)
HALDEX_CANL: P1.5 R8.1 U5.6(CANL)
HB_IN: P1.10 R4.2
HB_OUT: P1.11 Q2.3(C) R18.1
PWR_IN: D3.2(A) P1.1
RESET: C4.2 R6.1 SW3.2 U1.3(EN)
RGB_LED: LED3.4(Din) R16.1 U1.10(IO8)
SWITCH_MODE: R5.1 SW1.3 SW1.4 U1.17(IO19)
SWITCH_MODE_EXT: P1.7 R7.1 U1.16(IO18)
USB_D+: D6.4(I/O2) USB1.6(DP1) USB1.8(DP2)
USB_D-: D6.6(I/O1) USB1.5(DN2) USB1.7(DN1)
$1N3588: R15.2 USB1.4(CC1)
$1N3589: R17.2 USB1.10(CC2)
$1N3603: D3.1(K) D5.1(K) F1.2
$1N3655: LED1.1(A) R11.2
$1N7170: C10.1 D7.1(K) L1.1 U6.6(SW)
$1N7171: R21.1 R22.1 U6.3(FB)
$1N7173: C10.2 U6.1(CB)
$1N22027: LED2.1(A) R12.1
$1N22450: D9.1(K) R4.1 U4.2(A)
$1N23224: D8.1(K) R1.1 U3.2(A)

Not connected (* = marked no-connect by the designer): LED3 1(Dout)*; P1 12*; U1 4(IO4)* 5(IO5)* 8(IO0)* 9(IO1)* 22(NC)* 23(IO15)* 24(RXD0)* 25(TXD0)*; U2 5(VREF)*; U3 1(N.C)*; U4 1(N.C)*; U5 5(VREF)*; USB1 3(SBU2)* 9(SBU1)*

## Notes on the sheet
- ESP32 C6
- Inputs & Connectors
- CAN
- USB
- Outputs
- 1k?
- 1k?
- Power Management

# Board PCB1
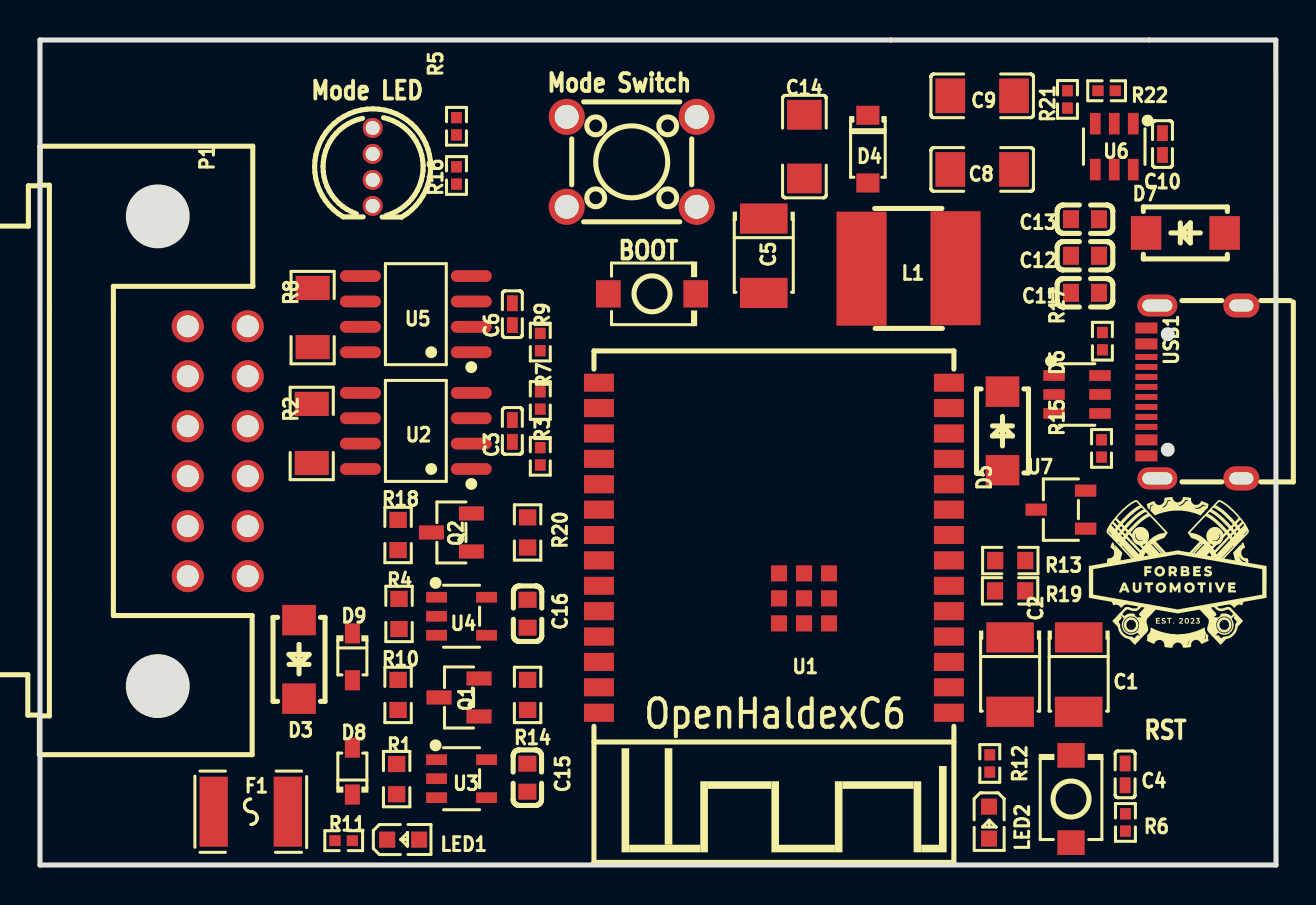
[diagram p1: board, top side]
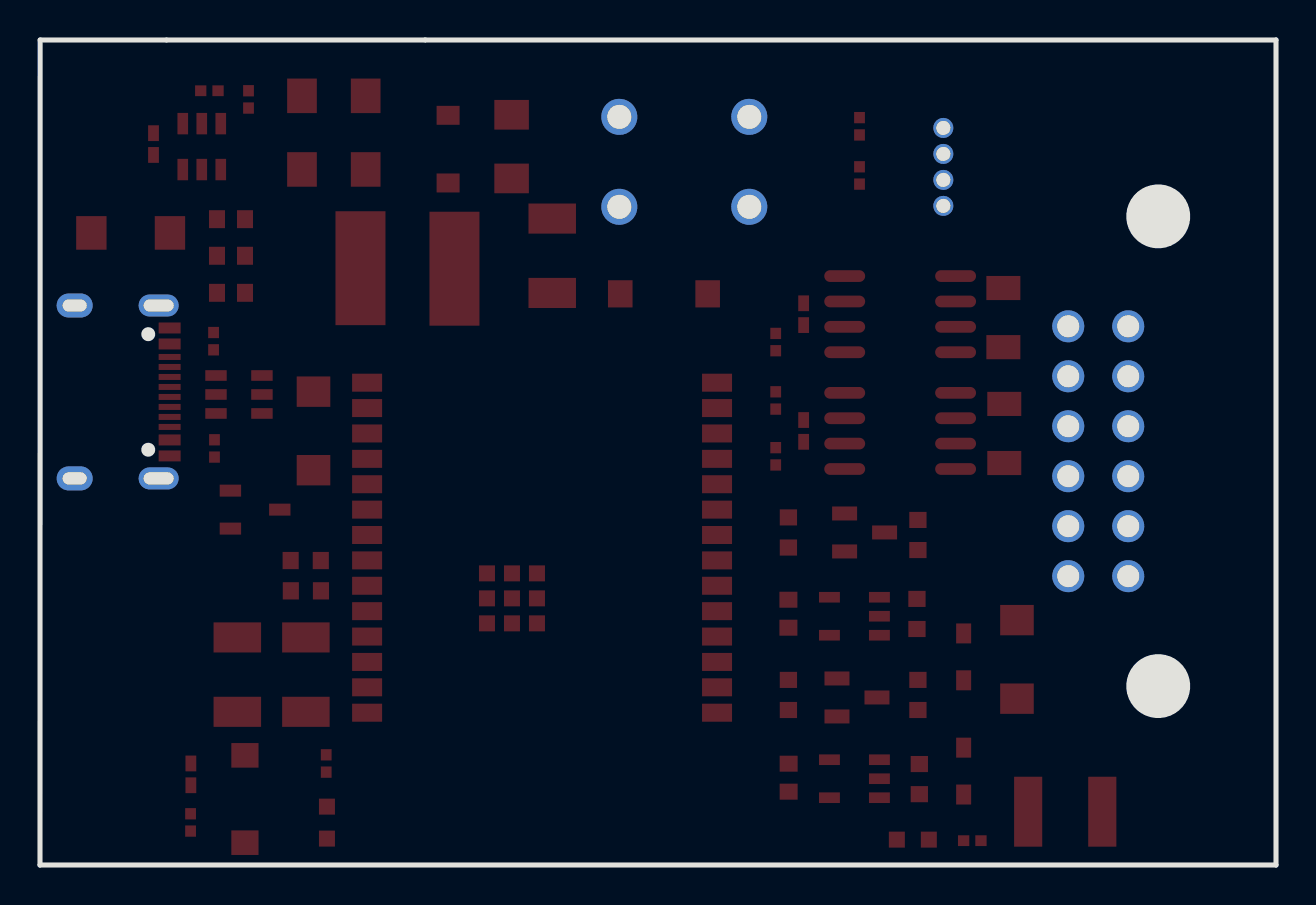
[diagram p2: board, bottom side, seen from below]

Outline 61.81 x 41.28 mm; copper layers: Top Layer, Bottom Layer. Coordinates in mm from the lower left corner of the outline.
Outline path: 0,0 0,41.28 61.8,41.28 61.81,0 0,0
Stack: Top Layer 0.035mm / Dielectric1 1.51mm FR4 er 4.5 / Bottom Layer 0.035mm

## Design rules (mm)
net USB_D-: DP5
net USB_D+: DP5
net CAN0_TX: DP4
net CAN1_RX: DP3
net CAN1_TX: DP3
net CAN0_RX: DP4
net CHASSIS_CANL: DP1
net CHASSIS_CANH: DP1
net HALDEX_CANL: DP2
net HALDEX_CANH: DP2
template: Custom Config
spacing copperThickness1oz (default): track to track 0.102, other pairs 0.152 to 0.3
spacing copperThickness2oz: track to track 0.203, other pairs 0.152 to 0.3
track width copperThickness1oz: min 0.127, default 0.254, max 2.54
track width copperThickness2oz (default): min 0.28, default 0.29, max 2.54
differential pair differentialPair (default): width min 0.127, default 0.254, max 2.54; gap min 0.152, default 0.152
via viaSize (default): diameter min 0.5, default 0.61, max 10; hole min 0.3, default 0.305, max 6.3

## Placement (name value [footprint] x y rotation side)
C1  100uF  [CASE-B_3528]  51.94 9.53 270 top
C2  100uF  [CASE-B_3528]  48.51 9.53 270 top
C3  100nF  [C0402]  23.62 21.72 90 top
C4  1uF  [C0402]  54.27 4.53 270 top
C5  100uF  [CASE-B_3528]  36.19 30.48 270 top
C6  100nF  [C0402]  23.62 27.56 90 top
C8  10uF  [C1206]  47.12 34.8 0 top
C9  10uF  [C1206]  47.12 38.48 0 top
C10  100nF  [C0402]  56.13 36.07 90 top
C11  22uF  [C0603]  52.26 28.63 180 top
C12  22uF  [C0603]  52.26 30.48 180 top
C13  22uF  [C0603]  52.26 32.31 180 top
C14  10uF  [C1206]  38.23 35.94 90 top
C15  100nF  [C0603]  24.37 4.37 90 top
C16  100nF  [C0603]  24.38 12.57 90 top
D3  SS14  [SMA_L4.2-W2.6-LS5.0-RD_1]  12.95 10.29 90 top
D4  SMF30A  [SOD-123_L2.8-W1.8-LS3.7-RD]  41.4 35.81 270 top
D5  SS14  [SMA_L4.2-W2.6-LS5.0-RD_1]  48.13 21.72 270 top
D6  USBLC6-2SC6  [SOT-23-6_L2.9-W1.6-P0.95-LS2.8-BL]  51.86 23.54 270 top
D7  SS14  [SMA_L4.2-W2.6-LS5.0-RD_1]  57.28 31.62 0 top
D8  BZT52C4V7S  [SOD-323_L1.8-W1.3-LS2.5-RD]  15.62 4.7 90 top
D9  BZT52C4V7S  [SOD-323_L1.8-W1.3-LS2.5-RD]  15.62 10.41 270 top
F1  MF-MSMF110/16-2  [F1812]  10.54 2.67 180 top
L1  10uH  [IND-SMD_L6.0-W6.0_FNR60XXS]  43.43 29.84 180 top
LED1  19-217/GHC-YR1S2/3T  [LED0603-RD]  18.16 1.27 0 top
LED2  19-217/GHC-YR1S2/3T  [LED0603-RD]  47.46 2.12 270 top
LED3  WS2812D-F5  [LED-TH_4P-BD5.8-P1.30]  16.64 34.92 270 top
P1  MX23A12NF1  [COON-TH_MX23A12NF1]  8.89 20.7 270 top
Q1  SS8050(RANGE:200-350)  [SOT-23-3_L2.9-W1.3-P1.90-LS2.4-BR]  20.96 8.38 0 top
Q2  SS8050(RANGE:200-350)  [SOT-23-3_L2.9-W1.3-P1.90-LS2.4-BR]  20.57 16.64 0 top
R1  1kΩ  [R0603]  17.84 4.3 90 top
R2  120Ω  [R1206]  13.59 21.59 90 top
R3  10kΩ  [R0402]  25.02 20.45 270 top
R4  1kΩ  [R0603]  17.96 12.56 90 top
R5  10kΩ  [R0402]  20.83 36.96 270 top
R6  10kΩ  [R0402]  54.28 2.13 270 top
R7  10kΩ  [R0402]  25.02 23.24 90 top
R8  120Ω  [R1206]  13.63 27.39 90 top
R9  10kΩ  [R0402]  25.02 26.16 270 top
R10  10kΩ  [R0603]  17.91 8.51 270 top
R11  2.2kΩ  [R0402]  15.19 1.22 0 top
R12  1kΩ  [R0402]  47.5 5.08 90 top
R13  330Ω  [R0603]  48.52 15.23 0 top
R14  10kΩ  [R0603]  24.38 8.51 270 top
R15  5.1kΩ  [R0402]  53.09 20.84 90 top
R16  10kΩ  [R0402]  20.83 34.5 270 top
R17  5.1kΩ  [R0402]  53.13 26.21 270 top
R18  10kΩ  [R0603]  17.91 16.51 90 top
R19  330Ω  [R0603]  48.51 13.72 0 top
R20  10kΩ  [R0603]  24.38 16.64 270 top
R21  33kΩ  [R0402]  51.38 38.3 270 top
R22  10kΩ  [R0402]  53.34 38.73 0 top
SW1  TS-1002-07026  [SW-TH_4P-L6.0-W6.0-P4.50-LS6.5]  29.59 35.18 0 top
SW2  TS-1088-AR02016  [SW-SMD_L3.9-W3.0-P4.45]  30.61 28.58 0 top
SW3  TS-1088-AR02016  [SW-SMD_L3.9-W3.0-P4.45]  51.56 3.3 90 top
U1  ESP32-C6-WROOM-1-N8  [WIRELM-SMD_ESP32-C6-WROOM-1]  36.7 15.88 180 top
U2  SN65HVD230DR  [SOIC-8_L4.9-W3.9-P1.27-LS6.0-BL]  18.8 21.72 90 top
U3  SN74LVC1G17DBVR  [SOT-23-5_L3.0-W1.5-P0.95-LS2.8-BL]  21.08 4.32 270 top
U4  SN74LVC1G17DBVR  [SOT-23-5_L3.0-W1.5-P0.95-LS2.8-BL]  21.08 12.45 270 top
U5  SN65HVD230DR  [SOIC-8_L4.9-W3.9-P1.27-LS6.0-BL]  18.8 27.56 90 top
U6  LMR14006XDDCR  [SOT-23-6_L2.9-W1.6-P0.95-LS2.8-BL]  53.72 35.94 180 top
U7  CH213K  [SOT-23-3_L2.9-W1.6-P1.90-LS2.8-BR]  51.05 17.78 0 top
USB1  TYPE-C 16PIN 2MD(073)  [USB-C-SMD_TYPE-C-6PIN-2MD-073]  57.7 23.67 90 top

## Footprints (pads in the part's own frame, mm; a bottom-side part is the same pattern mirrored in y, then rotated)
C0402
  rect 0.79x0.54 smd: 1(-0.545,0) 2(0.545,0)
C0603
  rect 0.8x0.9 smd: 1(-0.7,0) 2(0.7,0)
C1206
  rect 1.485x1.728 smd: 1(-1.593,0) 2(1.593,0)
CASE-B_3528
  rect 1.506x2.376 smd: 1(-1.861,0) 2(1.861,0)
COON-TH_MX23A12NF1
  round 1.6 hole 1.1: 1(6.25,1.5) 2(3.75,1.5) 3(1.25,1.5) 4(-1.25,1.5) 5(-3.75,1.5) 6(-6.25,1.5) 7(6.25,-1.5) 8(3.75,-1.5) 9(1.25,-1.5) 10(-1.25,-1.5) 11(-3.75,-1.5) 12(-6.25,-1.5)
F1812
  rect 1.407x3.499 smd: 1(-1.853,0) 2(1.853,0)
IND-SMD_L6.0-W6.0_FNR60XXS
  rect 2.5x5.7 smd: 1(-2.35,-0.013) 2(2.35,0.013)
LED0603-RD
  rect 0.8x0.8 smd: 1(-0.799,0) 2(0.799,0)
LED-TH_4P-BD5.8-P1.30
  round 1 hole 0.7: 1(1.95,0) 2(0.65,0) 3(-0.65,0) 4(-1.95,0)
R0402
  rect 0.566x0.54 smd: 1(-0.433,0) 2(0.433,0)
R0603
  rect 0.806x0.864 smd: 1(-0.753,0) 2(0.753,0)
R1206
  rect 1.208x1.701 smd: 1(-1.479,0) 2(1.479,0)
SMA_L4.2-W2.6-LS5.0-RD_1
  rect 1.52x1.68 smd: 1(-1.965,0) 2(1.965,0)
SOD-123_L2.8-W1.8-LS3.7-RD
  rect 0.95x1.15 smd: 1(-1.692,0) 2(1.692,0)
SOD-323_L1.8-W1.3-LS2.5-RD
  rect 1x0.75 smd: 1(-1.173,0) 2(1.173,0)
SOIC-8_L4.9-W3.9-P1.27-LS6.0-BL
  oval 0.588x2.045 smd: 1(-1.905,-2.772) 2(-0.635,-2.772) 3(0.635,-2.772) 4(1.905,-2.772) 5(1.905,2.772) 6(0.635,2.772) 7(-0.635,2.772) 8(-1.905,2.772)
SOT-23-3_L2.9-W1.3-P1.90-LS2.4-BR
  rect 1.25x0.7 smd: 1(1,-0.95) 2(1,0.95) 3(-1,0)
SOT-23-3_L2.9-W1.6-P1.90-LS2.8-BR
  rect 1.07x0.6 smd: 1(1.235,-0.95) 2(1.235,0.95) 3(-1.235,0)
SOT-23-5_L3.0-W1.5-P0.95-LS2.8-BL
  rect 0.532x1.045 smd: 1(-0.95,-1.25) 2(0,-1.25) 3(0.95,-1.25) 4(0.95,1.25) 5(-0.95,1.25)
SOT-23-6_L2.9-W1.6-P0.95-LS2.8-BL
  rect 0.532x1.072 smd: 1(-0.95,-1.149) 2(0,-1.149) 3(0.95,-1.149) 4(0.95,1.149) 5(0,1.149) 6(-0.95,1.149)
SW-SMD_L3.9-W3.0-P4.45
  rect 1.23x1.36 smd: 1(-2.185,0) 2(2.185,0)
SW-TH_4P-L6.0-W6.0-P4.50-LS6.5
  round 1.8 hole 1.2: 1(-3.25,2.25) 2(3.25,2.25) 3(-3.25,-2.25) 4(3.25,-2.25)
USB-C-SMD_TYPE-C-6PIN-2MD-073
  rect 0.55x1.1 smd: 1(-3.2,2.375) 2(-2.4,2.375) 11(2.4,2.375) 12(3.2,2.375)
  rect 0.3x1.1 smd: 3(-1.75,2.375) 4(-1.25,2.375) 5(-0.75,2.375) 6(-0.25,2.375) 7(0.25,2.375) 8(0.75,2.375) 9(1.25,2.375) 10(1.75,2.375)
  oval 1.1x2 hole 0.6x1.5: 13(-4.325,1.825) 14(4.325,1.825)
  oval 1.2x1.8 hole 0.6x1.2: 13(-4.325,-2.375) 14(4.325,-2.375)
WIRELM-SMD_ESP32-C6-WROOM-1
  rect 1.5x0.9 smd: 1(-8.75,8.255) 2(-8.75,6.985) 3(-8.75,5.715) 4(-8.75,4.445) 5(-8.75,3.175) 6(-8.75,1.905) 7(-8.75,0.635) 8(-8.75,-0.635) 9(-8.75,-1.905) 10(-8.75,-3.175) 11(-8.75,-4.445) 12(-8.75,-5.715) 13(-8.75,-6.985) 14(-8.75,-8.255) 15(8.75,-8.255) 16(8.75,-6.985) 17(8.75,-5.715) 18(8.75,-4.445) 19(8.75,-3.175) 20(8.75,-1.905) 21(8.75,-0.635) 22(8.75,0.635) 23(8.75,1.905) 24(8.75,3.175) 25(8.75,4.445) 26(8.75,5.715) 27(8.75,6.985) 28(8.75,8.255)
  rect 0.8x0.8 smd: 29(-2.755,3.785) 30(-1.505,3.785) 31(-0.255,3.785) 32(-0.255,2.535) 33(-1.505,2.535) 34(-2.755,2.535) 35(-2.755,1.285) 36(-1.505,1.285) 37(-0.255,1.285)

## Nets
As in the schematic.

Pads without a net: LED3 1; P1 12; U1 4 5 8 9 22 23 24 25; U2 5; U3 1; U4 1; U5 5; USB1 3 9

## Text on the board
Top Silkscreen Layer: Mode LED | Mode Switch | BOOT | RST | OpenHaldexC6
